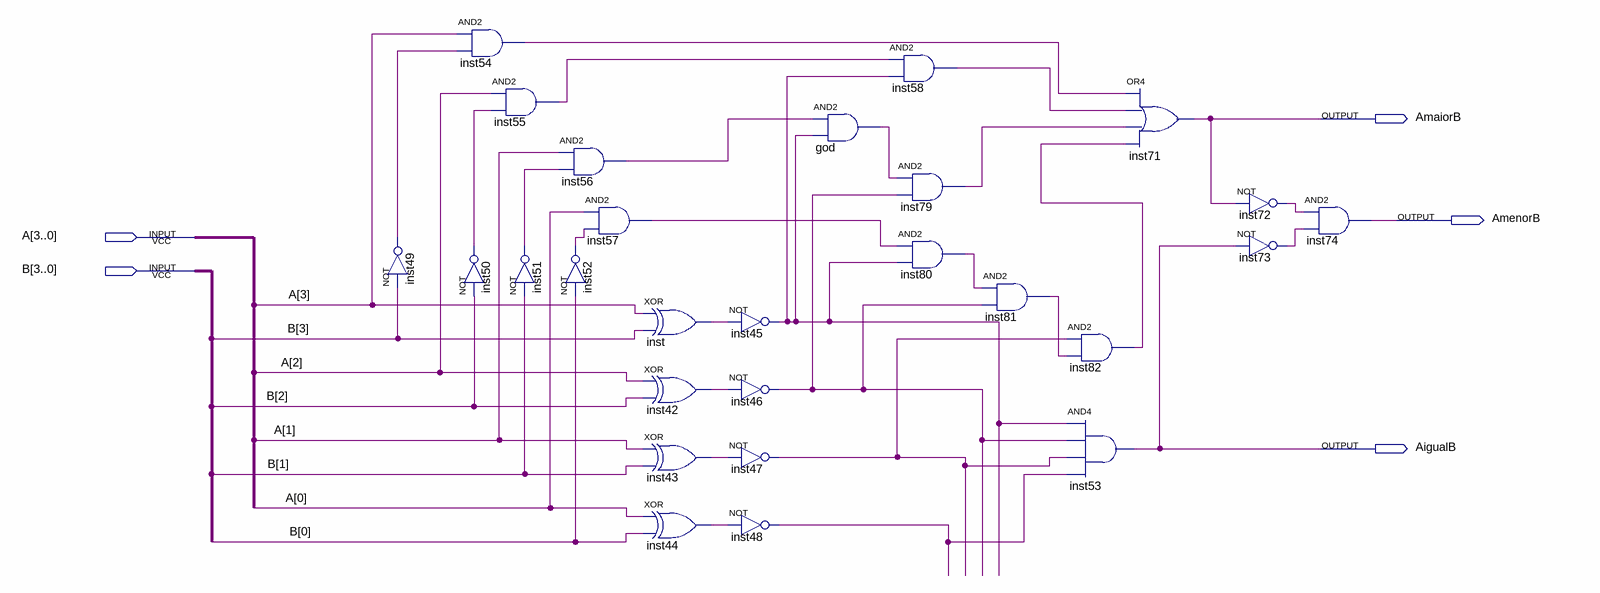
[diagram p0: schematic sheet]
// Quartus schematic comparador.bdf as structural Verilog: 27 symbols, 5 pins
module comparador (
  input  [3:0] A,
  input  [3:0] B,
  output AmaiorB,
  output AmenorB,
  output AigualB
);

  wire god_out, inst42_out, inst43_out, inst44_out, inst45_out, inst46_out, inst47_out, inst48_out,
       inst49_out, inst50_out, inst51_out, inst52_out, inst54_out, inst55_out, inst56_out, inst57_out,
       inst58_out, inst72_out, inst73_out, inst79_out, inst80_out, inst81_out, inst82_out, inst_out;

  not inst49 (inst49_out, B[3]);
  and inst54 (inst54_out, A[3], inst49_out);
  not inst50 (inst50_out, B[2]);
  and inst55 (inst55_out, A[2], inst50_out);
  not inst51 (inst51_out, B[1]);
  and inst56 (inst56_out, A[1], inst51_out);
  and inst57 (inst57_out, A[0], inst52_out);
  not inst52 (inst52_out, B[0]);
  xor inst (inst_out, A[3], B[3]);
  xor inst42 (inst42_out, A[2], B[2]);
  xor inst43 (inst43_out, A[1], B[1]);
  xor inst44 (inst44_out, A[0], B[0]);
  not inst45 (inst45_out, inst_out);
  not inst46 (inst46_out, inst42_out);
  not inst47 (inst47_out, inst43_out);
  not inst48 (inst48_out, inst44_out);
  and god (god_out, inst56_out, inst45_out);
  and inst58 (inst58_out, inst55_out, inst45_out);
  and inst79 (inst79_out, god_out, inst46_out);
  and inst80 (inst80_out, inst57_out, inst45_out);
  and inst81 (inst81_out, inst80_out, inst46_out);
  and inst82 (inst82_out, inst47_out, inst81_out);
  and inst53 (AigualB, inst45_out, inst46_out, inst47_out, inst48_out);
  or inst71 (AmaiorB, inst54_out, inst58_out, inst79_out, inst82_out);
  not inst72 (inst72_out, AmaiorB);
  not inst73 (inst73_out, AigualB);
  and inst74 (AmenorB, inst72_out, inst73_out);
endmodule
